# Altium schematic sheet SHDN-BSPD-S05-V00-Microcontroller.SchDoc: Microcontroller
size A3; DrawnBy: Jonn DIllon; DocumentNumber: 5; Revision: 01; SheetNumber: 5; SheetTotal: 10; Version: 01; Project: Shutdown Board 2020; PageSetup: Record=PageOptions|CenterHorizontal=True|CenterVertical=True|PrintScale=0.97|XCorrection=1.00|YCorrection=1.00|PrintKind=0|BorderSize=5000000|LeftOffset=0|BottomOffset=0|Orientation=2|PaperLength=1000|PaperWidth=1000|Scale=100|PaperSource=7|PrintQuality=-4|MediaType=1|DitherType=10|PaperKind=A4|PrintScaleMode=1
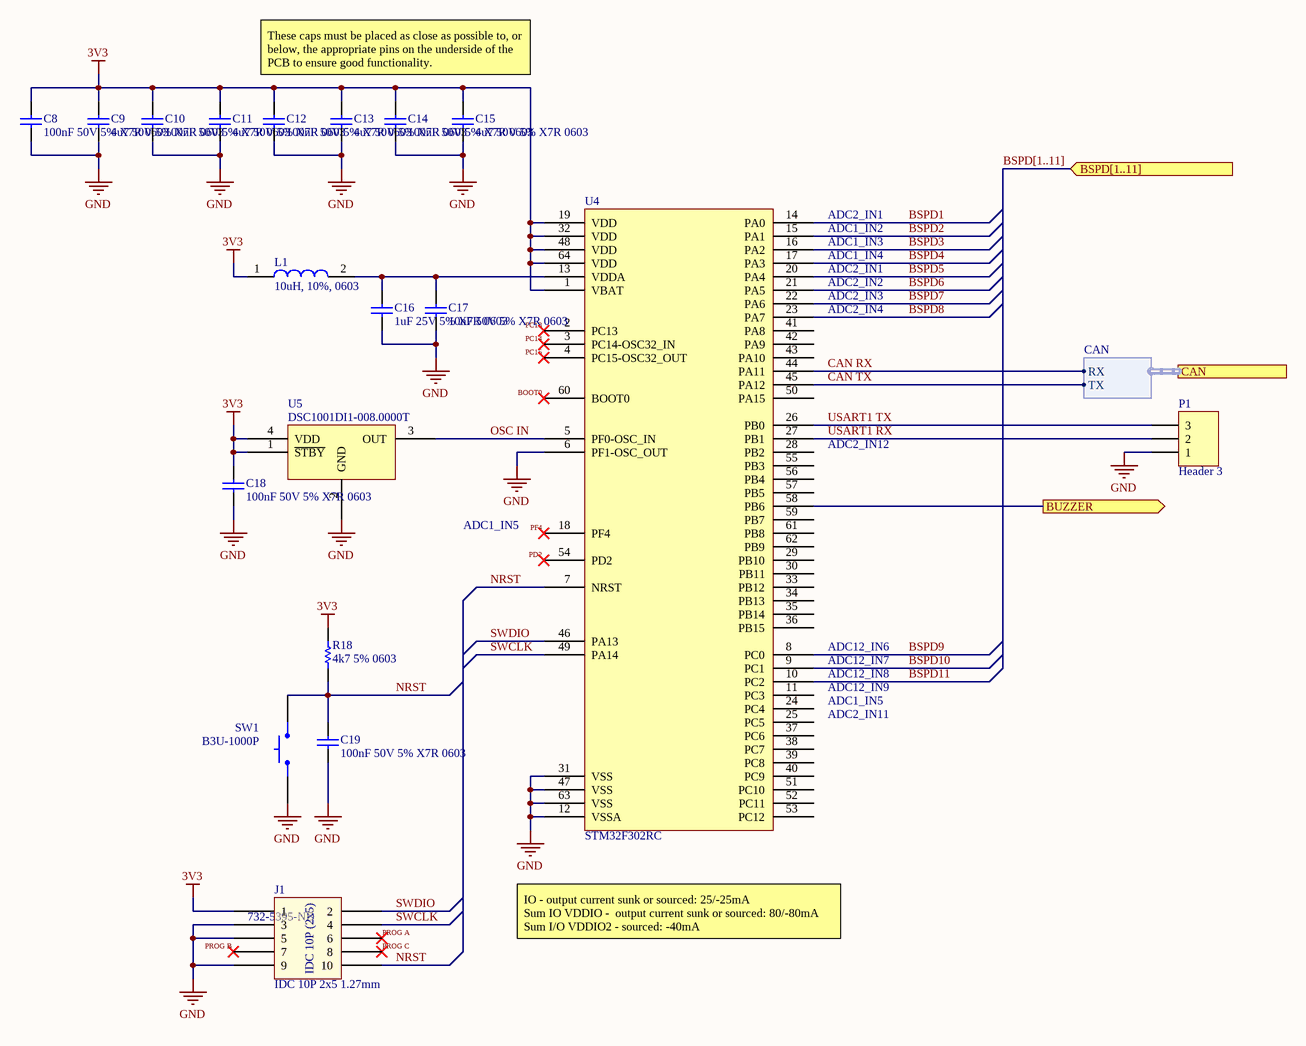
[diagram p0: SHDN-BSPD-S05-V00-Microcontroller.SchDoc]

## Parts
C8  100nF 50V 5% X7R 0603  [Cap_Ceramic_0603]
C9  4u7 50V 5% X7R 0603  [Cap_Ceramic_0603]
C10  100nF 50V 5% X7R 0603  [Cap_Ceramic_0603]
C11  4u7 50V 5% X7R 0603  [Cap_Ceramic_0603]
C12  100nF 50V 5% X7R 0603  [Cap_Ceramic_0603]
C13  4u7 50V 5% X7R 0603  [Cap_Ceramic_0603]
C14  100nF 50V 5% X7R 0603  [Cap_Ceramic_0603]
C15  4u7 50V 5% X7R 0603  [Cap_Ceramic_0603]
C16  1uF 25V 5% X7R 0603  [Cap_Ceramic_0603]
C17  10nF 50V 5% X7R 0603  [Cap_Ceramic_0603]
C18  100nF 50V 5% X7R 0603  [Cap_Ceramic_0603]
C19  100nF 50V 5% X7R 0603  [Cap_Ceramic_0603]
J1  IDC 10P 2x5 1.27mm  [IDC 1.27MM 10P]
L1  10uH, 10%, 0603  [Inductor_0603]
P1  Header 3  [HDR1X3]
R18  4k7 5% 0603  [Res_ThinFilm_0603]
SW1  B3U-1000P  [BTN B3U-1000P]
U4  STM32F302RC  [STM32F302RC]
U5  DSC1001DI1-008.0000T  [DSC1001DI1-008.0000TCT-ND]

## Ports
BSPD[1..11] (in), BUZZER (out), CAN (harness CAN)

## Harnesses
CAN: RX, TX

## Nets
3V3: C8.2 C9.2 C10.2 C11.2 C12.2 C13.2 C14.2 C15.2 C18.2 J1.1 L1.1 R18.2 U4.1(VBAT) U4.19(VDD) U4.32(VDD) U4.48(VDD) U4.64(VDD) U5.1(~{STBY}) U5.4(VDD)
GND: C8.1 C9.1 C10.1 C11.1 C12.1 C13.1 C14.1 C15.1 C16.1 C17.1 C18.1 C19.1 J1.3 J1.5 J1.9 P1.1 SW1.1 U4.6(PF1-OSC_OUT) U4.12(VSSA) U4.31(VSS) U4.47(VSS) U4.63(VSS) U5.2(GND)
BOOT0: U4.60(BOOT0)
BSPD1: U4.14(PA0)
BSPD2: U4.15(PA1)
BSPD3: U4.16(PA2)
BSPD4: U4.17(PA3)
BSPD5: U4.20(PA4)
BSPD6: U4.21(PA5)
BSPD7: U4.22(PA6)
BSPD8: U4.23(PA7)
BSPD9: U4.8(PC0)
BSPD10: U4.9(PC1)
BSPD11: U4.10(PC2)
BUZZER: U4.58(PB6) ; port BUZZER
CAN RX: U4.44(PA11) ; port CAN.RX
CAN TX: U4.45(PA12) ; port CAN.TX
NRST: C19.2 J1.10 R18.1 SW1.2 U4.7(NRST)
OSC IN: U4.5(PF0-OSC_IN) U5.3(OUT)
PC13: U4.2(PC13)
PC14: U4.3(PC14-OSC32_IN)
PC15: U4.4(PC15-OSC32_OUT)
PD2: U4.54(PD2)
PF4: U4.18(PF4)
PROG A: J1.6
PROG B: J1.7
PROG C: J1.8
SWCLK: J1.4 U4.49(PA14)
SWDIO: J1.2 U4.46(PA13)
USART1 RX: P1.2 U4.27(PB1)
USART1 TX: P1.3 U4.26(PB0)
NetC16_2: C16.2 C17.2 L1.2 U4.13(VDDA)

Not connected (* = marked no-connect by the designer): U4 11(PC3) 24(PC4) 25(PC5) 28(PB2) 29(PB10) 30(PB11) 33(PB12) 34(PB13) 35(PB14) 36(PB15) 37(PC6) 38(PC7) 39(PC8) 40(PC9) 41(PA8) 42(PA9) 43(PA10) 50(PA15) 51(PC10) 52(PC11) 53(PC12) 55(PB3) 56(PB4) 57(PB5) 59(PB7) 61(PB8) 62(PB9)

## Buses and harness runs
bus BSPD[1..11] = port BSPD[1..11]

## Notes on the sheet
- These caps must be placed as close as possible to, or below, the appropriate pins on the underside of the PCB to ensure good functionality.
- ADC2_IN1
- ADC2_IN2
- ADC1_IN4
- ADC1_IN3
- ADC1_IN2
- ADC2_IN4
- ADC2_IN3
- ADC2_IN12
- ADC1_IN5
- ADC12_IN6
- ADC12_IN7
- ADC12_IN8
- ADC12_IN9
- ADC2_IN11
- (near J1) 732-5395-ND
- IO - output current sunk or sourced: 25/-25mA
  Sum IO VDDIO -  output current sunk or sourced: 80/-80mA
  Sum I/O VDDIO2 - sourced: -40mA
- Revision History:
- Sheet Title:
- Rev
- Date
- Description
- Project:
- Size:
- Drawn By:
- A3
- Number:
- Revision:
- Sheet
- Version:
- of
- QUT Motorsport
- O-120, Gardens Point
- 2 George Street
- Brisbane, QLD 4000
- Australia
- Print Date:
- Print Time:
- File Name:
- (in symbol IDC 10P 2x5 1.27mm) IDC 10P (2x5)

## Library data of the parts
C8 C10 C12 C14 C18 C19 = 100nF 50V 5% X7R 0603: Capacitor, Ceramic, SMD, 100nF, 50V, 5%, X7R, 0603
C9 C11 C13 C15 = 4u7 50V 5% X7R 0603: Capacitor, Ceramic, SMD, 4u7, 50V, 5%, X7R, 0603
C16 = 1uF 25V 5% X7R 0603: Capacitor, Ceramic, SMD, 1uF, 25V, 5%, X7R, 0603
C17 = 10nF 50V 5% X7R 0603: Capacitor, Ceramic, SMD, 10nF, 50V, 5%, X7R, 0603
P1 = Header 3: Header, 3-Pin; LatestRevisionDate: 17-Jul-2002; LatestRevisionNote: Re-released for DXP Platform.; Publisher: Altium Limited
R18 = 4k7 5% 0603: Resistor, SMD, 4k7, 0.1W, 5%, 0603
SW1 = BTN B3U-1000P: Omron B3U-1000P Ultra Miniture Switch; ComponentLink1Description: LCSC; ComponentLink1URL: https://lcsc.com/product-detail/Tactile-Switches_BRIGHT-TSA063G50-250_C294565.html
U4 = STM32F302RC: ARM® Cortex®-M4 STM32F3 Microcontroller IC 32-Bit 72MHz 256KB (256K x 8) FLASH 64-LQFP (10x10); ComponentLink1Description: Digikey; ComponentLink1URL: https://www.digikey.com.au/product-detail/en/stmicroelectronics/STM32F302RCT6TR/497-19000-1-ND/9974332; ComponentLink2Description: Datasheet; ComponentLink2URL: http://www.st.com/content/ccc/resource/technical/document/datasheet/67/73/21/b9/f2/b3/4d/f8/DM00094064.pdf/files/DM00094064.pdf/jcr:content/translations/en.DM00094064.pdf
U5 = DSC1001DI1-008.0000T: 8MHz XO (Standard) CMOS Oscillator 1.8 ~ 3.3V Standby (Power Down) 4-SMD, No Lead
L1 = 10uH, 10%, 0603: ComponentLink1Description: Digikey; ComponentLink1URL: https://www.digikey.com.au/product-detail/en/w%C3%BCrth-elektronik/74404064221/732-7261-1-ND/5353241; ComponentLink2Description: LCSC A; ComponentLink2URL: https://lcsc.com/product-detail/Power-Inductors_Sunlord-SWPA6045S221MT_C91047.html; ComponentLink3Description: LCSC B; ComponentLink3URL: https://lcsc.com/product-detail/Power-Inductors_SXN-Shun-Xiang-Nuo-Elec-SMNR6045-221MT_C467145.html